# EAGLE schematic LED_array (EAGLE 9.1.2)
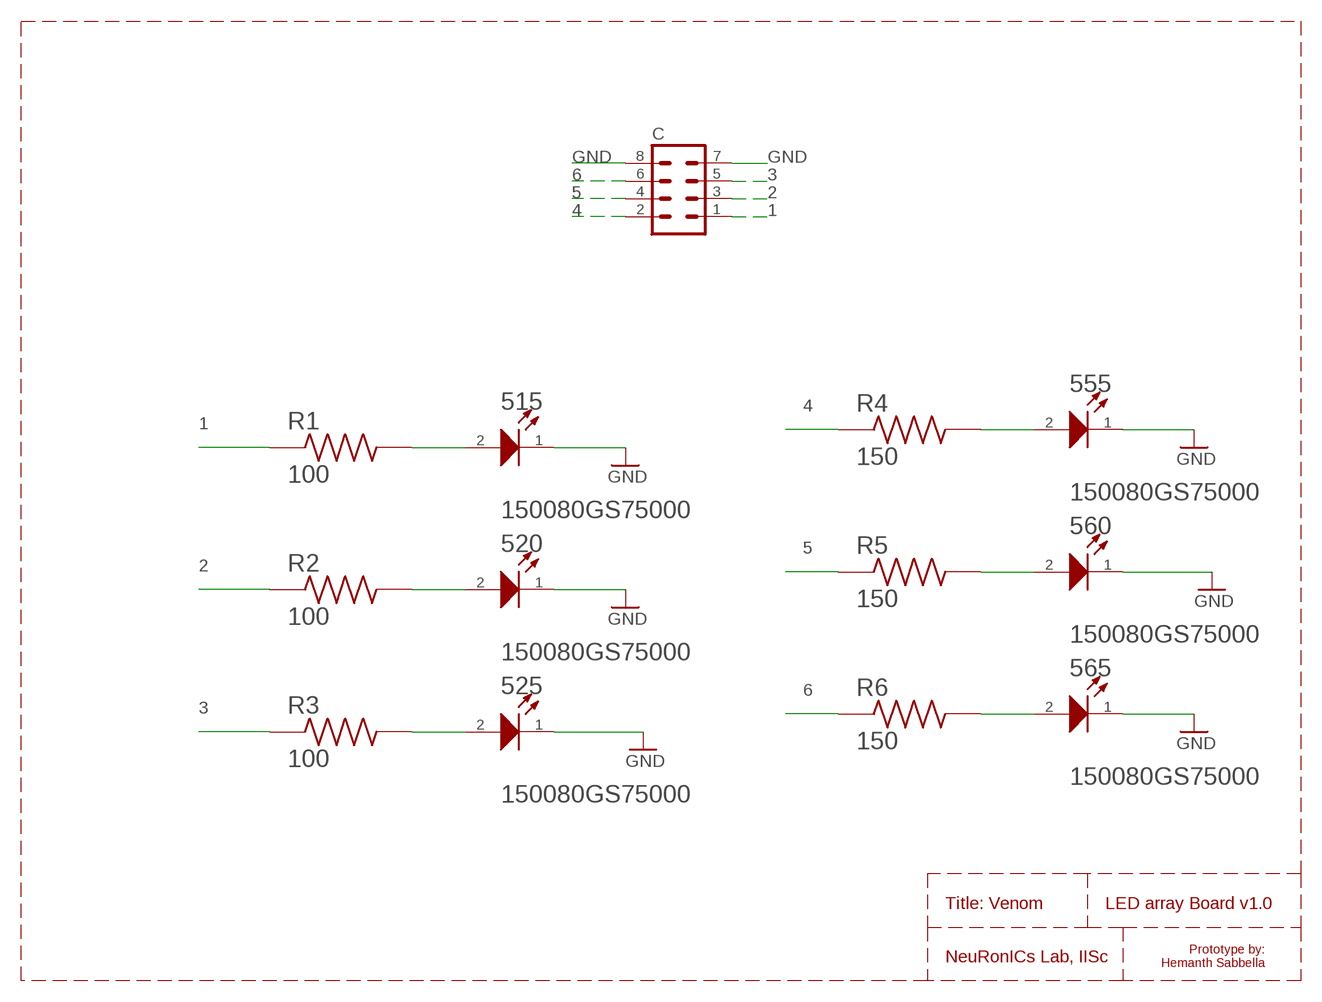
[diagram p0: schematic, sheet 1]

## Parts
515  WUERTH_ELEKTRONIK_150080GS75000WUERTH_ELEKTRONIK_150080GS75000_0_0  [WUERTH_ELEKTRONIK_150080GS75000_0]
520  WUERTH_ELEKTRONIK_150080GS75000WUERTH_ELEKTRONIK_150080GS75000_0_0  [WUERTH_ELEKTRONIK_150080GS75000_0]
525  WUERTH_ELEKTRONIK_150080GS75000WUERTH_ELEKTRONIK_150080GS75000_0_0  [WUERTH_ELEKTRONIK_150080GS75000_0]
555  WUERTH_ELEKTRONIK_150080GS75000WUERTH_ELEKTRONIK_150080GS75000_0_0  [WUERTH_ELEKTRONIK_150080GS75000_0]
560  WUERTH_ELEKTRONIK_150080GS75000WUERTH_ELEKTRONIK_150080GS75000_0_0  [WUERTH_ELEKTRONIK_150080GS75000_0]
565  WUERTH_ELEKTRONIK_150080GS75000WUERTH_ELEKTRONIK_150080GS75000_0_0  [WUERTH_ELEKTRONIK_150080GS75000_0]
C  MA04-2  [MA04-2]
R1  100  RCS1206150RFKEA  [RESC3116X65N]
R2  100  RCS1206150RFKEA  [RESC3116X65N]
R3  100  RCS1206150RFKEA  [RESC3116X65N]
R4  150  RCS1206150RFKEA  [RESC3116X65N]
R5  150  RCS1206150RFKEA  [RESC3116X65N]
R6  150  RCS1206150RFKEA  [RESC3116X65N]

## Nets
1: C.1 R1.1
2: C.3 R2.1
3: C.5 R3.1
4: C.2 R4.1
5: C.4 R5.1
6: C.6 R6.1
GND: 515.1(K) 520.1(K) 525.1(K) 555.1(K) 560.1(K) 565.1(K) C.7 C.8
N$1: 555.2(A) R4.2
N$2: 560.2(A) R5.2
N$3: 565.2(A) R6.2
N$4: 515.2(A) R1.2
N$5: 520.2(A) R2.2
N$6: 525.2(A) R3.2

## Notes on the sheet
- Title: Venom | LED array Board v1.0
- Prototype by:
  Hemanth Sabbella
- NeuRonICs Lab, IISc

## Library data of the parts
515 520 525 555 560 565 = Wuerth Elektronik - 150080GS75000:WUERTH_ELEKTRONIK_150080GS75000: WE-LED_K1A2-2; CIIVA_IDS: 12518865; COLOR: Green; COMPONENT_LINK_1_DESCRIPTION: Manufacturer URL; COMPONENT_LINK_1_URL: http://www.we-online.com; DATASHEET: http://katalog.we-online.com/led/datasheet/150080GS75000.pdf; FOOTPRINT_VARIANT_NAME_0: Manufacturer Recommended; IMPORTED: yes; IMPORTED_FROM: vault; IMPORT_TS: 1521861195; MF: Wuerth Elektronik; MPN: 150080GS75000; PACKAGE: 0805_A; PREFIX: LED; RELEASE_DATE: 1421305883; VAULT_GUID: 7CA29E68-737E-4B72-8298-495A0034E04A; VAULT_REVISION: 176256F5-FDF0-497E-BE5F-A62C8B2BC32C
C = con-lstb:MA04-2: PIN HEADER; OC_FARNELL: unknown; OC_NEWARK: unknown
R1-R6 = RCS1206150RFKEA:RCS1206150RFKEA; DESCRIPTION: RCS1206 100 150R 1% ET1 E3; DIGI-KEY_PART_NUMBER: 541-10575-1-ND; DIGI-KEY_PURCHASE_URL: https://www.digikey.in/product-detail/en/vishay-dale/RCS1206150RFKEA/541-10575-1-ND/10059941?utm_source=snapeda&utm_medium=aggregator&utm_campaign=symbol; MF: Vishay; MP: RCS1206150RFKEA; PACKAGE: 3116 Vishay